# EAGLE design NEW_MAIN (EAGLE 9.6.2)
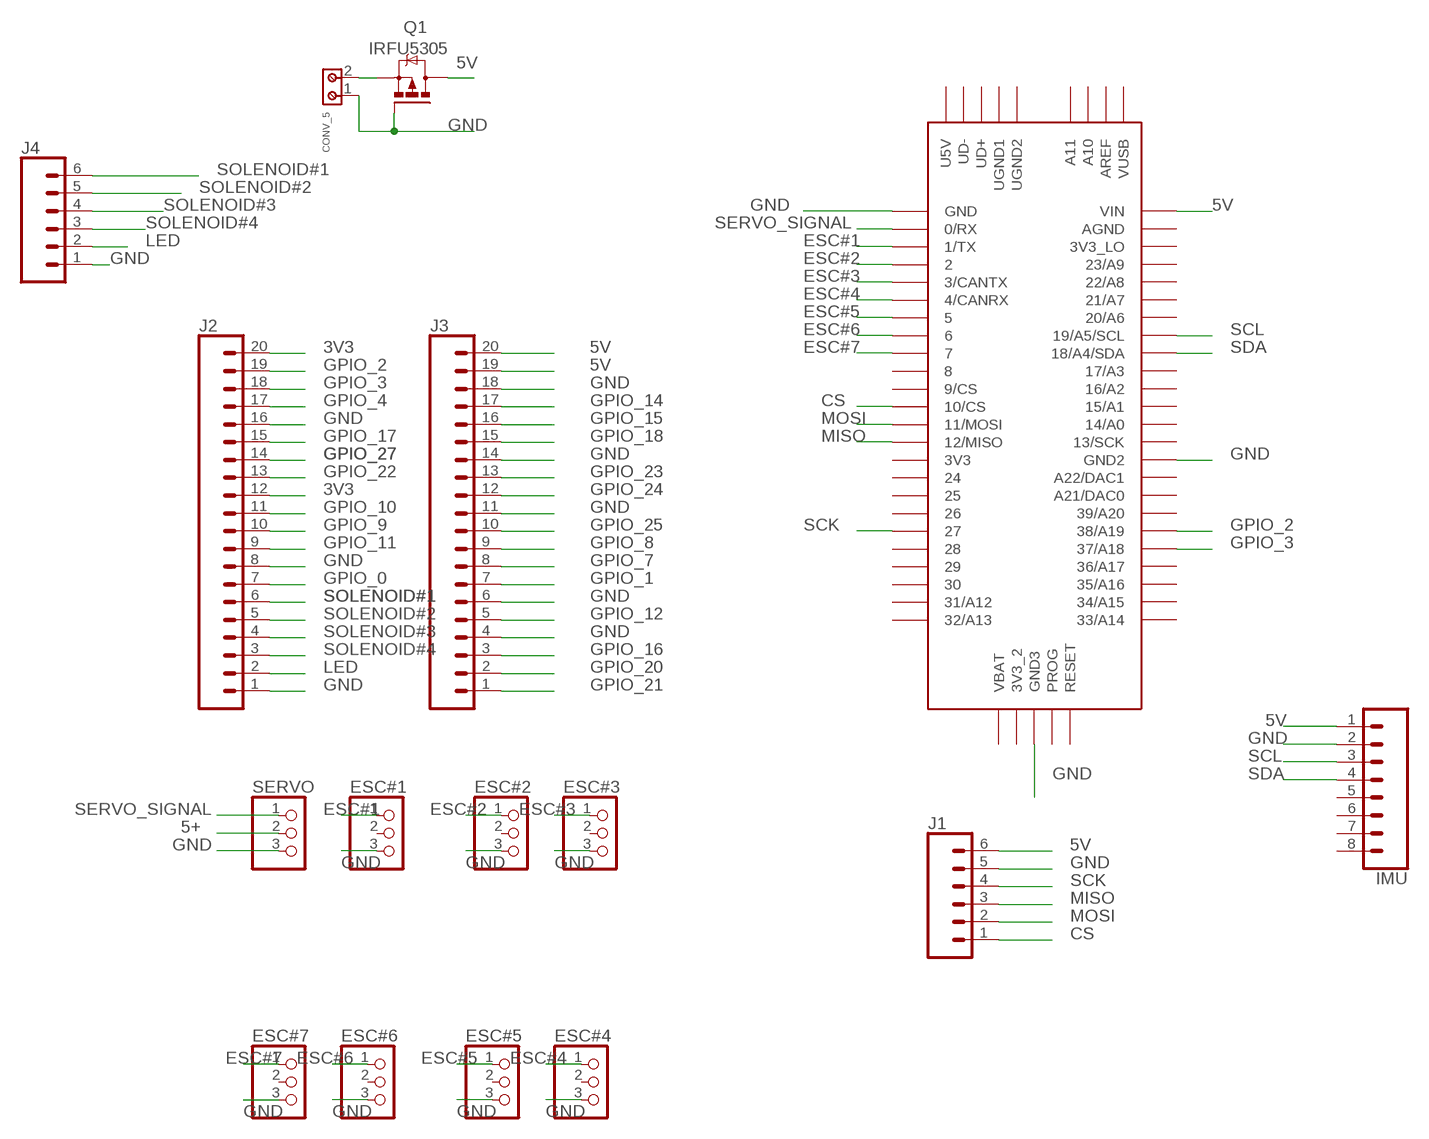
[diagram p0: schematic, sheet 1]

## Parts
CONV_5  691213500002  [691213500002]
ESC#1  PINHD-1X3  [1X03]
ESC#2  PINHD-1X3  [1X03]
ESC#3  PINHD-1X3  [1X03]
ESC#4  PINHD-1X3  [1X03]
ESC#5  PINHD-1X3  [1X03]
ESC#6  PINHD-1X3  [1X03]
ESC#7  PINHD-1X3  [1X03]
IMU  CONN_08"  [1X08]
J1  CONN_06LOCK  [1X06_LOCK]
J2  CONN_20  [1X20]
J3  CONN_20  [1X20]
J4  CONN_06FEMALE_LOCK  [1X06_FEMALE_LOCK.010]
Q1  IRFU5305  [I-PAK_TO251AA]
SERVO  PINHD-1X3  [1X03]
U$1  TEENSY_3.5/3.6  [TEENSY_3.5/3.6]

## Nets
3V3: J2.12 J2.20
5+: SERVO.2
5V: IMU.1 J1.6 J3.19 J3.20 Q1.2(D) U$1.VIN
CS: J1.1 U$1.10/CS
ESC#1: ESC#1.1 U$1.1/TX
ESC#2: ESC#2.1 U$1.2
ESC#3: ESC#3.1 U$1.3/CANTX
ESC#4: ESC#4.1 U$1.4/CANRX
ESC#5: ESC#5.1 U$1.5
ESC#6: ESC#6.1 U$1.6
ESC#7: ESC#7.1 U$1.7
GND: CONV_5.1 ESC#1.3 ESC#2.3 ESC#3.3 ESC#4.3 ESC#5.3 ESC#6.3 ESC#7.3 IMU.2 J1.5 J2.1 J2.8 J2.16 J3.4 J3.6 J3.11 J3.14 J3.18 J4.1 Q1.1(G) SERVO.3 U$1.GND U$1.GND2 U$1.GND3
GPIO_0: J2.7
GPIO_1: J3.7
GPIO_2: J2.19 U$1.38/A19
GPIO_3: J2.18 U$1.37/A18
GPIO_4: J2.17
GPIO_7: J3.8
GPIO_8: J3.9
GPIO_9: J2.10
GPIO_10: J2.11
GPIO_11: J2.9
GPIO_12: J3.5
GPIO_14: J3.17
GPIO_15: J3.16
GPIO_16: J3.3
GPIO_17: J2.15
GPIO_18: J3.15
GPIO_20: J3.2
GPIO_21: J3.1
GPIO_22: J2.13
GPIO_23: J3.13
GPIO_24: J3.12
GPIO_25: J3.10
GPIO_27: J2.14
LED: J2.2 J4.2
MISO: J1.3 U$1.12/MISO
MOSI: J1.2 U$1.11/MOSI
N$3: CONV_5.2 Q1.3(S)
SCK: J1.4 U$1.27
SCL: IMU.3 U$1.19/A5/SCL
SDA: IMU.4 U$1.18/A4/SDA
SERVO_SIGNAL: SERVO.1 U$1.0/RX
SOLENOID#1: J2.6 J4.6
SOLENOID#2: J2.5 J4.5
SOLENOID#3: J2.4 J4.4
SOLENOID#4: J2.3 J4.3
Unconnected: ESC#1.2 ESC#2.2 ESC#3.2 ESC#4.2 ESC#5.2 ESC#6.2 ESC#7.2 IMU.5 IMU.6 IMU.7 IMU.8 U$1.3V3 U$1.3V3_2 U$1.3V3_LO U$1.8 U$1.9/CS U$1.13/SCK U$1.14/A0 U$1.15/A1 U$1.16/A2 U$1.17/A3 U$1.20/A6 U$1.21/A7 U$1.21/DAC0(A21/DAC0) U$1.22/A8 U$1.23/A9 U$1.24 U$1.25 U$1.26 U$1.28 U$1.29 U$1.30 U$1.31/A12 U$1.32/A13 U$1.33/A14 U$1.34/A15 U$1.35/A16 U$1.36/A17 U$1.39/A20 U$1.A10 U$1.A11 U$1.A22/DAC1 U$1.AGND U$1.AREF U$1.PROG U$1.RESET U$1.U5V U$1.UD+ U$1.UD- U$1.UGND1 U$1.UGND2 U$1.VBAT U$1.VUSB

## Library data of the parts
CONV_5 = Wurth_Connectors_WR-TBL Rising Cage Clamp:691213500002: WR-TBL Serie 2135 - 5.08 mm Vertical Entry Modular w. Rising Cage Clamp KIND PROPERTIES Pitch 5.08 mm MATERIAL PROPERTIES Insulator Material PA66 Insulator Flammability Rating UL94 V-0 Contact Material Copper Alloy Contact Plating Tin over Nickel Terminal Screw Material Steel Terminal Screw Plating Zinc Wire Guard Material Copper Alloy GENERAL INFORMATION Operating Temperature -30 up to +120 °C Compliance RoHS ELECTRICAL PROPERTIES IR cULus 14 A IR VDE 14 A Working Voltage [cULus] 300 V (AC) Working Voltage [VDE] 250 V (AC) Withstanding Voltage [UL] 1600 V (AC) Withstanding Voltage [cULus] 1600 Withstanding Voltage [VDE] 2000 Contact Resistance [cULus] 20 mΩ Contact Resistance [VDE] 20 mΩ MECHANICAL PROPERTIES Wire Strip Length 6 Screw M3 CERTIFICATION cULus Approval E150931 VDE Approval 40021366 PACKAGING PROPERTIES Packaging Box <https://www.we-online.com/catalog/media/o58403v209%20Family_WR-TBL_5_08_2135_VERTICAL_CABLE_ENTRY_W_RISING_CLAMP_6912135000XX.jpg> Details see: https://www.we-online.com/catalog/en/TBL_5_08_2135_VERTICAL_CABLE_ENTRY_W_RISING_CLAMP_6912135000XX/ Updated by Ella Wu 2019-11-26 2019(C) Wurth Elektronik; IR-UL: 14A; IR-VDE: 14A; PART-NUMBER: 691213500002; PINS: 2; PITCH: 5.08mm; TYPE: Vertical; WIRE: 14 to 30 (AWG) 2.08 to 0.0509 (mm²); WORKING-VOLTAGE-UL: 300V (AC); WORKING-VOLTAGE-VDE: 250V (AC)
ESC#1-ESC#7 SERVO = adafruit:PINHD-1X3: PIN HEADER
IMU = SparkFun-Connectors:CONN_08: Multi connection point. Often used as Generic Header-pin footprint for 0.1 inch spaced/style header connections On any of the 0.1 inch spaced packages, you can populate with these: Break Away Headers - Straight <https://www.sparkfun.com/products/116> (PRT-00116) Break Away Male Headers - Right Angle <https://www.sparkfun.com/products/553> (PRT-00553) Female Headers <https://www.sparkfun.com/products/115> (PRT-00115) Break Away Headers - Machine Pin <https://www.sparkfun.com/products/117> (PRT-00117) Break Away Female Headers - Swiss Machine Pin <https://www.sparkfun.com/products/743> (PRT-00743) Arduino Stackable Header - 8 Pin <https://www.sparkfun.com/products/9279> (PRT-09279) For SCREWTERMINALS and SPRING TERMINALS visit here: Screw Terimnals on SparkFun.com <https://www.sparkfun.com/search/results?term=Screw+Terminals> (5mm/3.5mm/2.54mm spacing) This device is also useful as a general connection point to wire up your design to another part of your project. Our various solder wires solder well into these plated through hole pads. Hook-Up Wire - Assortment (Stranded, 22 AWG) <https://www.sparkfun.com/products/11375> (PRT-11375) Hook-Up Wire - Assortment (Solid Core, 22 AWG) <https://www.sparkfun.com/products/11367> (PRT-11367) View the entire wire category on our website here <https://www.sparkfun.com/categories/141> Special notes: Molex polarized connector foot print use with SKU : PRT-08231 with associated crimp pins and housings. 1MM SMD Version SKU: PRT-10208 NOTES ON THE VARIANTS LOCK and LOCK_LONGPADS... This footprint was designed to help hold the alignment of a through-hole component (i.e. 6-pin header) while soldering it into place. You may notice that each hole has been shifted either up or down by 0.005 of an inch from it's more standard position (which is a perfectly straight line). This slight alteration caused the pins (the squares in the middle) to touch the edges of the holes. Because they are alternating, it causes a "brace" to hold the component in place. 0.005 has proven to be the perfect amount of "off-center" position when using our standard breakaway headers. Although looks a little odd when you look at the bare footprint, once you have a header in there, the alteration is very hard to notice. Also,if you push a header all the way into place, it is covered up entirely on the bottom side.; PROD_ID: CONN-08438
J1 J4 = SparkFun-Connectors:CONN_06: Multi connection point. Often used as Generic Header-pin footprint for 0.1 inch spaced/style header connections On any of the 0.1 inch spaced packages, you can populate with these: Break Away Headers - Straight <https://www.sparkfun.com/products/116> (PRT-00116) Break Away Male Headers - Right Angle <https://www.sparkfun.com/products/553> (PRT-00553) Female Headers <https://www.sparkfun.com/products/115> (PRT-00115) Break Away Headers - Machine Pin <https://www.sparkfun.com/products/117> (PRT-00117) Break Away Female Headers - Swiss Machine Pin <https://www.sparkfun.com/products/743> (PRT-00743) Arduino Stackable Header - 6 Pin <https://www.sparkfun.com/products/9280> (PRT-09280) Screw Terminals 2.54mm Pitch (6-Pin) <https://www.sparkfun.com/products/16499> (PRT-16499) For SCREWTERMINALS and SPRING TERMINALS visit here: Screw Terimnals on SparkFun.com <https://www.sparkfun.com/search/results?term=Screw+Terminals> (5mm/3.5mm/2.54mm spacing) This device is also useful as a general connection point to wire up your design to another part of your project. Our various solder wires solder well into these plated through hole pads. Hook-Up Wire - Assortment (Stranded, 22 AWG) <https://www.sparkfun.com/products/11375> (PRT-11375) Hook-Up Wire - Assortment (Solid Core, 22 AWG) <https://www.sparkfun.com/products/11367> (PRT-11367) View the entire wire category on our website here <https://www.sparkfun.com/categories/141>
J2 J3 = SparkFun-Connectors:CONN_20: Multi connection point. Often used as Generic Header-pin footprint for 0.1 inch spaced/style header connections On any of the 0.1 inch spaced packages, you can populate with these: Break Away Headers - Straight <https://www.sparkfun.com/products/116> (PRT-00116) Break Away Male Headers - Right Angle <https://www.sparkfun.com/products/553> (PRT-00553) Female Headers <https://www.sparkfun.com/products/115> (PRT-00115) Break Away Headers - Machine Pin <https://www.sparkfun.com/products/117> (PRT-00117) Break Away Female Headers - Swiss Machine Pin <https://www.sparkfun.com/products/743> (PRT-00743) For SCREWTERMINALS and SPRING TERMINALS visit here: Screw Terimnals on SparkFun.com <https://www.sparkfun.com/search/results?term=Screw+Terminals> (5mm/3.5mm/2.54mm spacing) This device is also useful as a general connection point to wire up your design to another part of your project. Our various solder wires solder well into these plated through hole pads. Hook-Up Wire - Assortment (Stranded, 22 AWG) <https://www.sparkfun.com/products/11375> (PRT-11375) Hook-Up Wire - Assortment (Solid Core, 22 AWG) <https://www.sparkfun.com/products/11367> (PRT-11367) View the entire wire category on our website here <https://www.sparkfun.com/categories/141> Special notes: Molex polarized connector foot print use with SKU : PRT-08231 with associated crimp pins and housings. 1MM SMD Version SKU: PRT-10208 NOTES ON THE VARIANTS LOCK and LOCK_LONGPADS... This footprint was designed to help hold the alignment of a through-hole component (i.e. 6-pin header) while soldering it into place. You may notice that each hole has been shifted either up or down by 0.005 of an inch from it's more standard position (which is a perfectly straight line). This slight alteration caused the pins (the squares in the middle) to touch the edges of the holes. Because they are alternating, it causes a "brace" to hold the component in place. 0.005 has proven to be the perfect amount of "off-center" position when using our standard breakaway headers. Although looks a little odd when you look at the bare footprint, once you have a header in there, the alteration is very hard to notice. Also,if you push a header all the way into place, it is covered up entirely on the bottom side. Note about LOCK SPECIAL package: This is just like the LOCK variant in that the holes are staggared by 5 mil, but except for the last two holes. They are not altered from the "standard" footprint layout. This is used for a special purpose on the layout of our Graphic LCD Backpack. Make sure you want to use this device before selecting it for you project!
Q1 = transistor-power:IRF?5305: HEXFET Power MOSFET Source: http://www.irf.com/product-info/datasheets/data/irfr5305pbf.pdf
U$1 = Teensy356:TEENSY_3.5/3.6

## Board
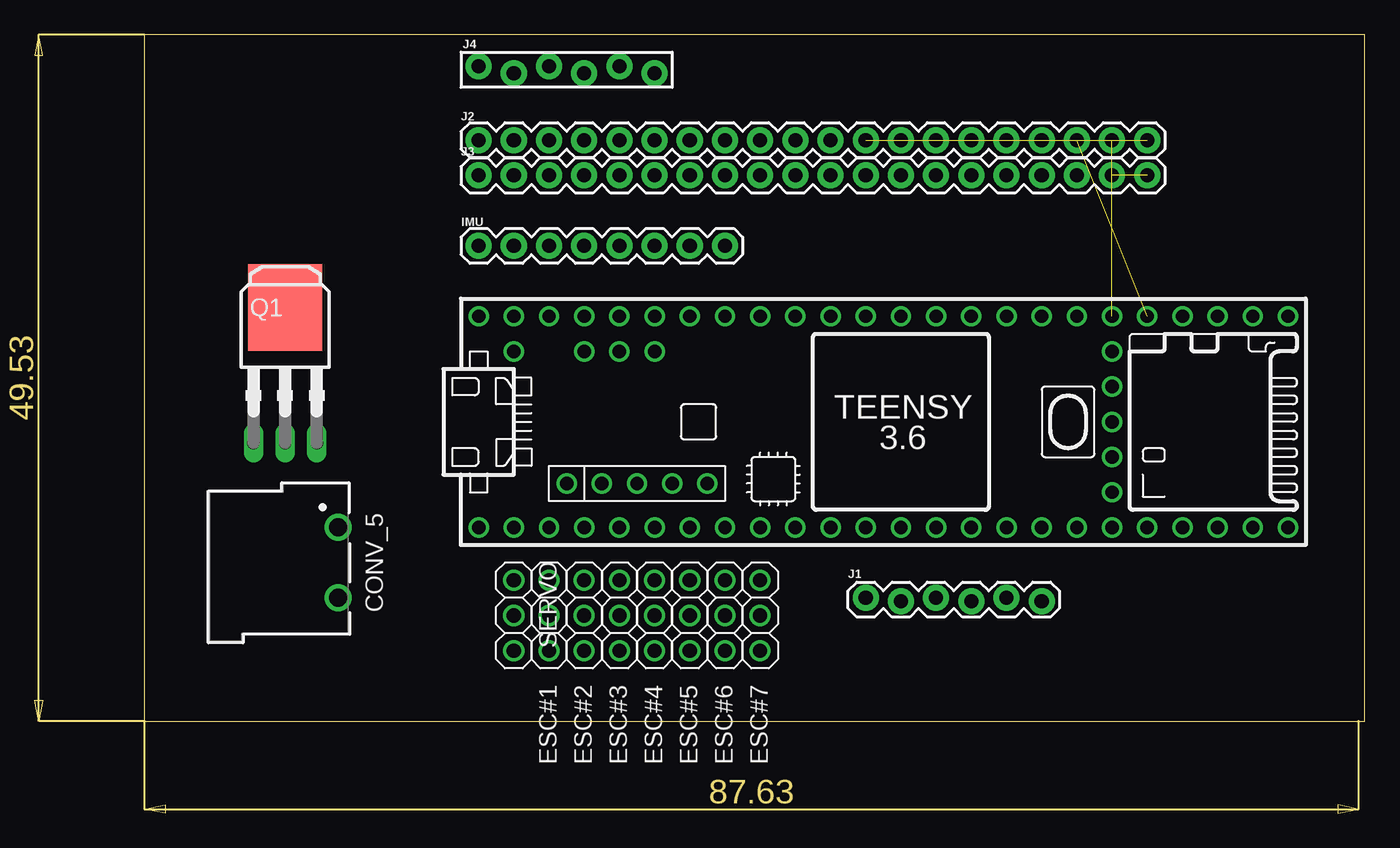
[diagram p1: board, top side]
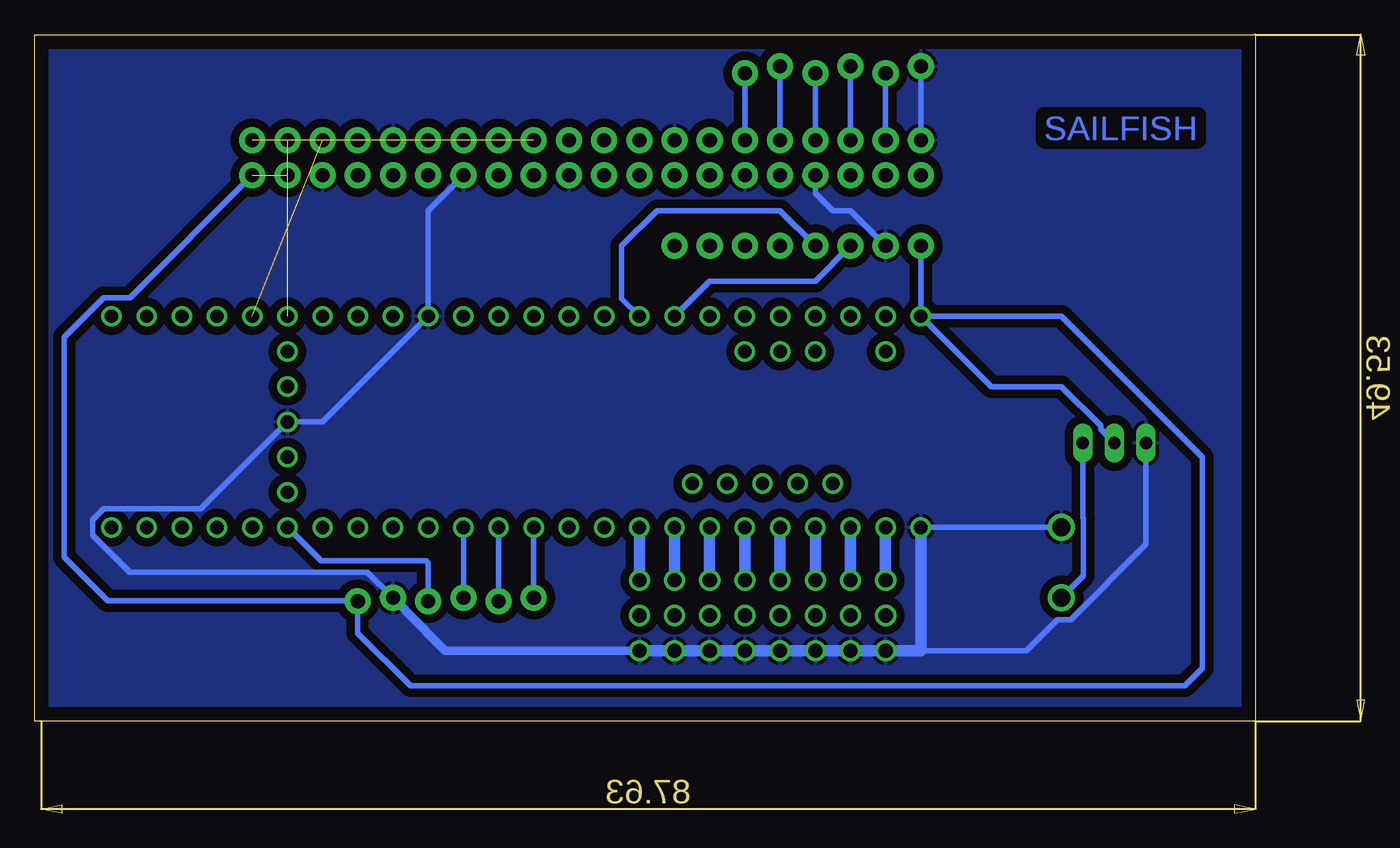
[diagram p2: board, bottom side, seen from below]

Size 88.1 x 49.52 mm. Coordinates in mm from the lower left corner, seen from the top.
Outline: 0,0 88.1,0 88.1,49.52 0,49.52 0,0
Copper layers (1*16): Top 0.035mm / dielectric 1.5mm / Bottom 0.035mm
Design rules "default *": minimum track width 0.4mm, minimum drill 0.35mm, track to track 0.4mm, track to pad 0.4mm, pad to pad 6mil, via to via 6mil, smd to smd 6mil, copper to edge 40mil, drill to drill 6mil, minimum pad ring 10mil, minimum via ring 8mil, stop-mask expansion 4mil, vias tented up to drill 0mil, thermal gap 10mil

### Footprints (pad centres in the part's own frame; a part is rotated, then mirrored left to right if it is on the bottom)
691213500002 = drill 1.3: 1 -2.54,0; 2 2.54,0
1X03 = drill 1.016: 1 -2.54,0; 2 0,0; 3 2.54,0
1X08 = drill 1.016 pad 1.88: 1 0,0; 2 2.54,0; 3 5.08,0; 4 7.62,0; 5 10.16,0; 6 12.7,0; 7 15.24,0; 8 17.78,0
1X06_LOCK = drill 1.016 pad 1.88: 1 0,0; 2 2.54,-0.254; 3 5.08,0; 4 7.62,-0.254; 5 10.16,0; 6 12.7,-0.254
1X20 = drill 1.016 pad 1.88: 1 0,0; 2 2.54,0; 3 5.08,0; 4 7.62,0; 5 10.16,0; 6 12.7,0; 7 15.24,0; 8 17.78,0; 9 20.32,0; 10 22.86,0; 11 25.4,0; 12 27.94,0; 13 30.48,0; 14 33.02,0; 15 35.56,0; 16 38.1,0; 17 40.64,0; 18 43.18,0; 19 45.72,0; 20 48.26,0
1X06_FEMALE_LOCK.010 = drill 1.016 pad 1.88: 1 0,0.254; 2 2.54,-0.254; 3 5.08,0.254; 4 7.62,-0.254; 5 10.16,0.254; 6 12.7,-0.254
I-PAK_TO251AA = drill 0.889 long: 1 -2.286,-5.334; 2 0,-5.334; 3 2.286,-5.334 | smd 5.334 x 6.223: 4 0,4.445
TEENSY_3.5/3.6 = drill 0.965: 0/RX -25.4,-7.62; 1/TX -22.86,-7.62; 2 -20.32,-7.62; 3/CANTX -17.78,-7.62; 3V3 7.62,-7.62; 3V3_2 17.78,-2.54; 3V3_LO -22.86,7.62; 4/CANRX -15.24,-7.62; 5 -12.7,-7.62; 6 -10.16,-7.62; 7 -7.62,-7.62; 8 -5.08,-7.62; 9/CS -2.54,-7.62; 10/CS 0,-7.62; 11/MOSI 2.54,-7.62; 12/MISO 5.08,-7.62; 13/SCK 5.08,7.62; 14/A0 2.54,7.62; 15/A1 0,7.62; 16/A2 -2.54,7.62; 17/A3 -5.08,7.62; 18/A4/SDA -7.62,7.62; 19/A5/SCL -10.16,7.62; 20/A6 -12.7,7.62; 21/A7 -15.24,7.62; 21/DAC0 12.7,7.62; 22/A8 -17.78,7.62; 23/A9 -20.32,7.62; 24 10.16,-7.62; 25 12.7,-7.62; 26 15.24,-7.62; 27 17.78,-7.62; 28 20.32,-7.62; 29 22.86,-7.62; 30 25.4,-7.62; 31/A12 27.94,-7.62; 32/A13 30.48,-7.62; 33/A14 30.48,7.62; 34/A15 27.94,7.62; 35/A16 25.4,7.62; 36/A17 22.86,7.62; 37/A18 20.32,7.62; 38/A19 17.78,7.62; 39/A20 15.24,7.62; A10 -17.78,5.08; A11 -15.24,5.08; A22/DAC1 10.16,7.62; AGND -25.4,7.62; AREF -20.32,5.08; GND -27.94,-7.62; GND2 7.62,7.62; GND3 17.78,0; PROG 17.78,2.54; RESET 17.78,5.08; U5V -21.59,-4.445; UD+ -16.51,-4.445; UD- -19.05,-4.445; UGND1 -13.97,-4.445; UGND2 -11.43,-4.445; VBAT 17.78,-5.08; VIN -27.94,7.62; VUSB -25.4,5.08

### Placement (x,y rotation side)
CONV_5  13.97,11.43 270 top
ESC#1  29.21,7.62 270 top
ESC#2  31.75,7.62 270 top
ESC#3  34.29,7.62 270 top
ESC#4  36.83,7.62 270 top
ESC#5  39.37,7.62 270 top
ESC#6  41.91,7.62 270 top
ESC#7  44.45,7.62 270 top
IMU  24.13,34.29 0 top
J1  52.07,8.89 0 top
J2  24.13,41.91 0 top
J3  24.13,39.37 0 top
J4  24.13,46.99 0 top
Q1  10.16,25.4 0 top
SERVO  26.67,7.62 270 top
U$1  52.07,21.59 0 top

### Tracks (layer width: path | path; a pad name or v marks a point on that pad's centre or on a via)
3V3  (1 unrouted)
5V  (1 unrouted)
  Bottom 0.406: U$1.VIN 19.05,24.13 13.97,24.13 11.14,21.3 11.14,21.05 Q1.2 | U$1.VIN 13.97,29.21 3.81,19.05 3.81,3.81 5.08,2.54 60.96,2.54 64.77,6.35 J1.6 64.81,8.67 82.83,8.67 85.97,11.81 85.97,27.69 83.11,30.55 81.21,30.55 J3.20 | IMU.1 U$1.VIN
CS
  Bottom 0.406: U$1.10/CS J1.1
ESC#1
  Bottom 0.813: U$1.1/TX ESC#1.1
ESC#2
  Bottom 0.813: U$1.2 ESC#2.1
ESC#3
  Bottom 0.813: U$1.3/CANTX ESC#3.1
ESC#4
  Bottom 0.813: ESC#4.1 U$1.4/CANRX
ESC#5
  Bottom 0.813: ESC#5.1 U$1.5
ESC#6
  Bottom 0.813: ESC#6.1 U$1.6
ESC#7
  Bottom 0.813: U$1.7 ESC#7.1
GND
  Bottom 0.406: CONV_5.1 U$1.GND | Q1.1 7.87,12.75 13.32,7.31 14.28,7.31 16.51,5.08 SERVO.3 | IMU.2 29.21,36.83 30.48,36.83 31.75,38.1 J3.4 | J4.1 J2.1 | J3.14 59.69,36.83 U$1.GND2 67.31,21.59 U$1.GND3 76.13,15.31 83.11,15.31 83.89,14.53 83.89,13.41 81.23,10.75 64.09,10.75 J1.5
  Bottom 0.61: J1.5 61.34,8 61.34,7.96 58.46,5.08 ESC#7.3
  Bottom 0.813: U$1.GND 24.13,5.08 SERVO.3 ESC#1.3 ESC#2.3 ESC#3.3 ESC#4.3 ESC#5.3 ESC#6.3 ESC#7.3
  pour Bottom (isolate 0.61): 0,49.53 0,0 88.14,0 88.14,49.53
GPIO_2  (1 unrouted)
GPIO_3  (1 unrouted)
LED
  Bottom 0.406: J4.2 J2.2
MISO
  Bottom 0.406: U$1.12/MISO J1.3
MOSI
  Bottom 0.406: U$1.11/MOSI J1.2
N$3
  Bottom 0.406: Q1.3 12.45,14.68 12.39,14.62 12.39,10.47 CONV_5.2
SCK
  Bottom 0.406: J1.4 59.69,11.43 59.82,11.56 67.44,11.56 U$1.27
SCL
  Bottom 0.406: U$1.19/A5/SCL 39.37,31.75 31.75,31.75 IMU.3
SDA
  Bottom 0.406: IMU.4 34.29,36.83 43.18,36.83 45.72,34.29 45.72,30.48 U$1.18/A4/SDA
SERVO_SIGNAL
  Bottom 0.813: U$1.0/RX SERVO.1
SOLENOID#1
  Bottom 0.406: J4.6 J2.6
SOLENOID#2
  Bottom 0.406: J4.5 J2.5
SOLENOID#3
  Bottom 0.406: J4.4 J2.4
SOLENOID#4
  Bottom 0.406: J4.3 J2.3

### Text on the board
Bottom: SAILFISH | SAILFISH